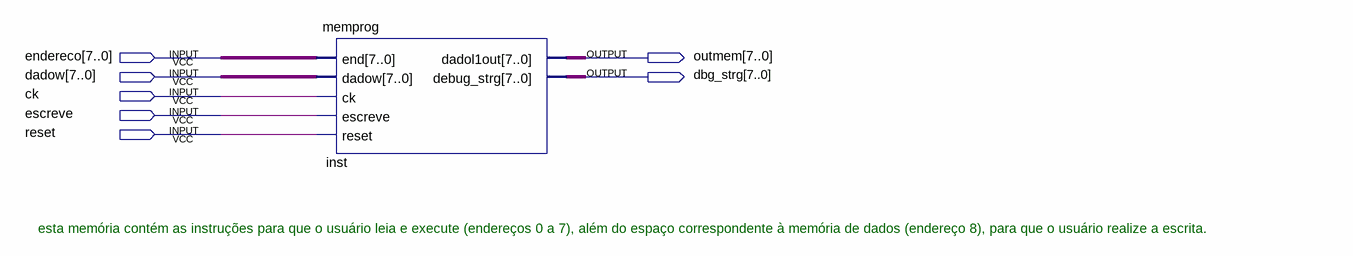
[diagram p0: schematic sheet]
// Quartus schematic regmem.bdf as structural Verilog: 1 symbols, 7 pins
module regmem (
  input  [7:0] endereco,
  input  [7:0] dadow,
  input  ck,
  input  escreve,
  input  reset,
  output [7:0] outmem,
  output [7:0] dbg_strg
);

  memprog inst (
    .\end (endereco), .dadow(dadow), .ck(ck), .escreve(escreve), .reset(reset), .dadol1out(outmem),
    .debug_strg(dbg_strg));

  // Notes on the sheet:
  //   esta memória contém as instruções para que o usuário leia e execute (endereços 0 a 7), além do espaço correspondente à memória de dados (endereço 8), para que o usuário realize a escrita. 
endmodule
